# EAGLE design Turnout Decoder V1.1 (EAGLE 8.3.0)
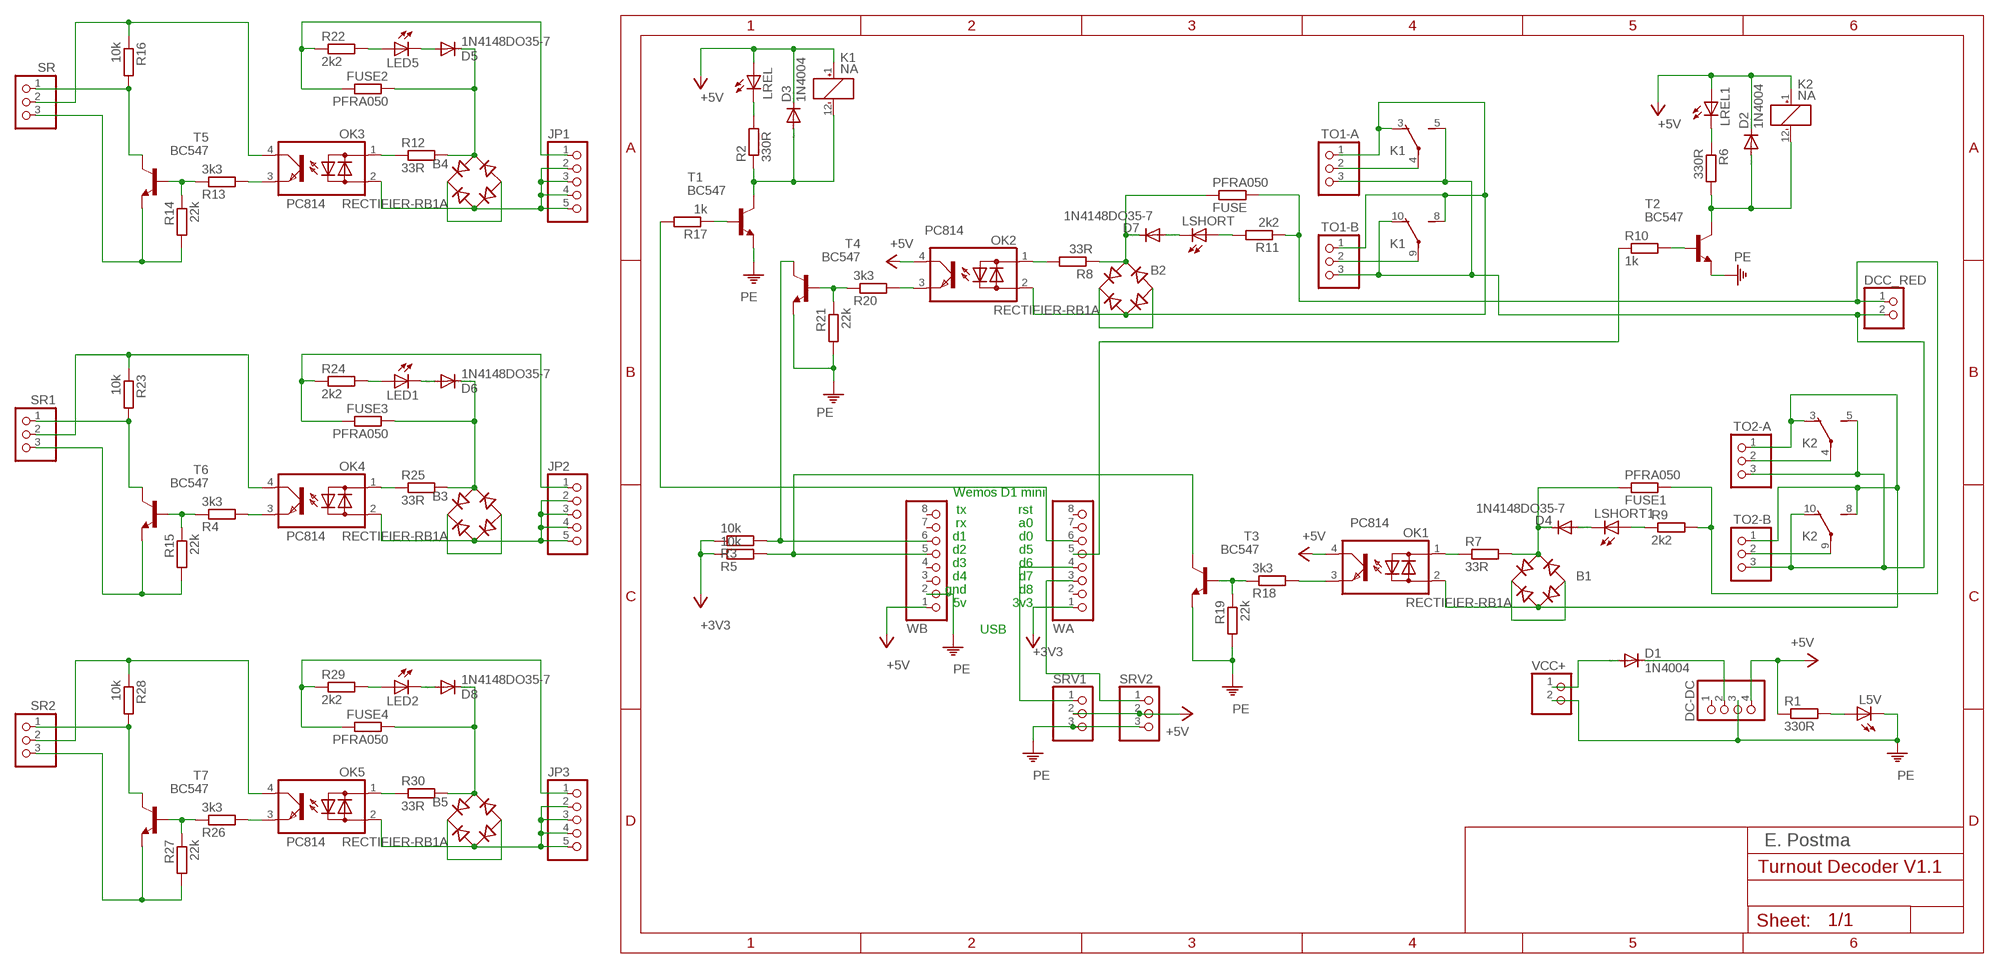
[diagram p0: schematic, sheet 1]

## Parts
B1  RECTIFIER-RB1A  [RB1A]
B2  RECTIFIER-RB1A  [RB1A]
B3  RECTIFIER-RB1A  [RB1A]
B4  RECTIFIER-RB1A  [RB1A]
B5  RECTIFIER-RB1A  [RB1A]
D1  1N4004  [DO41-10]
D2  1N4004  [DO41-10]
D3  1N4004  [DO41-10]
D4  1N4148DO35-7  [DO35-7]
D5  1N4148DO35-7  [DO35-7]
D6  1N4148DO35-7  [DO35-7]
D7  1N4148DO35-7  [DO35-7]
D8  1N4148DO35-7  [DO35-7]
DC-DC  PINHD-1X4  [1X04]
DCC_RED  PINHD-1X2  [1X02]
FUSE  PFRA050  R-EU_0414/5V  [0414V]
FUSE1  PFRA050  R-EU_0414/5V  [0414V]
FUSE2  PFRA050  R-EU_0414/5V  [0414V]
FUSE3  PFRA050  R-EU_0414/5V  [0414V]
FUSE4  PFRA050  R-EU_0414/5V  [0414V]
JP1  PINHD-1X5  [1X05]
JP2  PINHD-1X5  [1X05]
JP3  PINHD-1X5  [1X05]
K1  NA  [NA]
K2  NA  [NA]
L5V  LED3MM  [LED3MM]
LED1  LED3MM  [LED3MM]
LED2  LED3MM  [LED3MM]
LED5  LED3MM  [LED3MM]
LREL  LED3MM  [LED3MM]
LREL1  LED3MM  [LED3MM]
LSHORT  LED3MM  [LED3MM]
LSHORT1  LED3MM  [LED3MM]
OK1  PC814  [DIL04]
OK2  PC814  [DIL04]
OK3  PC814  [DIL04]
OK4  PC814  [DIL04]
OK5  PC814  [DIL04]
R1  330R  R-EU_0207/7  [0207/7]
R2  330R  R-EU_0207/7  [0207/7]
R3  10k  R-EU_0207/7  [0207/7]
R4  3k3  R-EU_0207/7  [0207/7]
R5  10k  R-EU_0207/7  [0207/7]
R6  330R  R-EU_0207/7  [0207/7]
R7  33R  R-EU_0207/7  [0207/7]
R8  33R  R-EU_0207/7  [0207/7]
R9  2k2  R-EU_0207/7  [0207/7]
R10  1k  R-EU_0207/7  [0207/7]
R11  2k2  R-EU_0207/7  [0207/7]
R12  33R  R-EU_0207/7  [0207/7]
R13  3k3  R-EU_0207/7  [0207/7]
R14  22k  R-EU_0207/7  [0207/7]
R15  22k  R-EU_0207/7  [0207/7]
R16  10k  R-EU_0207/7  [0207/7]
R17  1k  R-EU_0207/7  [0207/7]
R18  3k3  R-EU_0207/7  [0207/7]
R19  22k  R-EU_0207/7  [0207/7]
R20  3k3  R-EU_0207/7  [0207/7]
R21  22k  R-EU_0207/7  [0207/7]
R22  2k2  R-EU_0207/7  [0207/7]
R23  10k  R-EU_0207/7  [0207/7]
R24  2k2  R-EU_0207/7  [0207/7]
R25  33R  R-EU_0207/7  [0207/7]
R26  3k3  R-EU_0207/7  [0207/7]
R27  22k  R-EU_0207/7  [0207/7]
R28  10k  R-EU_0207/7  [0207/7]
R29  2k2  R-EU_0207/7  [0207/7]
R30  33R  R-EU_0207/7  [0207/7]
SR  PINHD-1X3  [1X03]
SR1  PINHD-1X3  [1X03]
SR2  PINHD-1X3  [1X03]
SRV1  PINHD-1X3  [1X03]
SRV2  PINHD-1X3  [1X03]
T1  BC547  [TO92]
T2  BC547  [TO92]
T3  BC547  [TO92]
T4  BC547  [TO92]
T5  BC547  [TO92]
T6  BC547  [TO92]
T7  BC547  [TO92]
TO1-A  PINHD-1X3  [1X03]
TO1-B  PINHD-1X3  [1X03]
TO2-A  PINHD-1X3  [1X03]
TO2-B  PINHD-1X3  [1X03]
VCC+  PINHD-1X2  [1X02]
WA  PINHD-1X8  [1X08]
WB  PINHD-1X8  [1X08]

## Nets
+3V3 [3.3V]: R3.1 R5.1 WA.1
+5V [5V]: D2.C D3.C DC-DC.4 K1.1(1:+) K2.1(1:+) LREL1.A LREL.A OK1.4(C) OK2.4(C) R1.1 SRV1.2 SRV2.2 WB.1
N$1: OK3.1(AC1) R12.1
N$2: LREL1.K(C) R6.1
N$3 [Rijstroom+]: DCC_RED.1 FUSE1.2 FUSE.2 R9.2 R11.1
N$4 [5V]: D1.A VCC+.1
N$5: OK1.1(AC1) R7.1
N$6: LSHORT1.A R9.1
N$7: D4.A LSHORT1.K(C)
N$8: D2.A K2.12(1:-) R6.2 T2.3(C)
N$9: R10.2 T2.2(B)
N$10 [Rijstroom+]: B1.+ B1.-
N$11: OK1.3(E) R18.2
N$12: LREL.K(C) R2.2
N$13 [Rijstroom+]: K2.4(2:P) TO2-A.2
N$14 [Rijstroom+]: B2.AC2 K1.3(2:O) K1.8(3:S) OK2.2(AC2) TO1-A.1 TO1-B.1
N$15 [Rijstroom-]: K2.9(3:P) TO2-B.2
N$16 [Rijstroom-]: DCC_RED.2 K1.5(2:S) K1.10(3:O) K2.5(2:S) K2.10(3:O) TO1-A.3 TO1-B.3 TO2-A.3 TO2-B.3
N$17: OK2.3(E) R20.2
N$18 [Rijstroom+]: B1.AC2 K2.3(2:O) K2.8(3:S) OK1.2(AC2) TO2-A.1 TO2-B.1
N$19: R3.2 T4.3(C) WB.6
N$20 [Rijstroom+]: B1.AC1 D4.C FUSE1.1 R7.2
N$21: OK2.1(AC1) R8.2
N$22: R5.2 T3.3(C) WB.5
N$23 [Rijstroom+]: B2.AC1 D7.C FUSE.1 R8.1
N$24: LED5.A R22.2
N$25: D5.A LED5.K(C)
N$26 [Rijstroom+]: K1.4(2:P) TO1-A.2
N$27: R18.1 R19.1 T3.2(B)
N$28: R20.1 R21.1 T4.2(B)
N$29: R17.2 WA.6
N$30 [Rijstroom+]: B4.AC1 D5.C FUSE2.1 R12.2
N$31: SRV1.1 WA.4
N$32 [Rijstroom-]: K1.9(3:P) TO1-B.2
N$33: SRV2.1 WA.3
N$34: R10.1 WA.5
N$35: LSHORT.A R11.2
N$36 [Rijstroom+]: B4.+ B4.-
N$37 [Rijstroom+]: FUSE2.2 JP1.1 R22.1
N$38: R13.1 R14.1 T5.2(B)
N$39: R16.2 SR.1 T5.3(C)
N$40 [Rijstroom+]: B4.AC2 JP1.2 JP1.3 JP1.4 JP1.5 OK3.2(AC2)
N$41: D7.A LSHORT.K(C)
N$42 [Rijstroom+]: B2.+ B2.-
N$43: OK3.3(E) R13.2
N$44: OK4.1(AC1) R25.1
N$45 [5V]: OK3.4(C) R16.1 SR.2
N$46: L5V.A R1.2
N$47: LED1.A R24.2
N$48: D6.A LED1.K(C)
N$49: R17.1 T1.2(B)
N$50: D3.A K1.12(1:-) R2.1 T1.3(C)
N$51 [Rijstroom+]: B3.AC1 D6.C FUSE3.1 R25.2
N$52 [Rijstroom+]: B3.+ B3.-
N$53 [Rijstroom+]: FUSE3.2 JP2.1 R24.1
N$54 [Rijstroom+]: B3.AC2 JP2.2 JP2.3 JP2.4 JP2.5 OK4.2(AC2)
N$55: R4.1 R15.1 T6.2(B)
N$56: R23.2 SR1.1 T6.3(C)
N$57: OK4.3(E) R4.2
N$58 [5V]: D1.C DC-DC.2
N$59 [5V]: OK4.4(C) R23.1 SR1.2
N$60 [Gnd]: R14.2 SR.3 T5.1(E)
N$61 [Gnd]: R15.2 SR1.3 T6.1(E)
N$62: OK5.1(AC1) R30.1
N$63: LED2.A R29.2
N$64: D8.A LED2.K(C)
N$65 [Rijstroom+]: B5.AC1 D8.C FUSE4.1 R30.2
N$66 [Rijstroom+]: B5.+ B5.-
N$67 [Rijstroom+]: FUSE4.2 JP3.1 R29.1
N$68 [Rijstroom+]: B5.AC2 JP3.2 JP3.3 JP3.4 JP3.5 OK5.2(AC2)
N$69: R26.1 R27.1 T7.2(B)
N$70: R28.2 SR2.1 T7.3(C)
N$71: OK5.3(E) R26.2
N$72 [5V]: OK5.4(C) R28.1 SR2.2
N$73 [Gnd]: R27.2 SR2.3 T7.1(E)
PE [Gnd]: DC-DC.3 L5V.K(C) R19.2 R21.2 SRV1.3 SRV2.3 T1.1(E) T2.1(E) T3.1(E) T4.1(E) VCC+.2 WB.2
Unconnected: DC-DC.1 WA.2 WA.7 WA.8 WB.3 WB.4 WB.7 WB.8

## Notes on the sheet
- Wemos D1 mini
- tx | rst
- rx | a0
- d1 | d0
- d2 | d5
- d3 | d6
- d4 | d7
- gnd | d8
- 5v | 3v3
- USB
- E. Postma

## Library data of the parts
B1-B5 = rectifier:RECTIFIER-: Rectifier
D1-D3 = diode:1N4004: DIODE general purpose rectifier, 1 A
D4-D8 = diode:1N4148: DIODE high speed (Philips)
DC-DC = pinhead:PINHD-1X4: PIN HEADER
DCC_RED VCC+ = pinhead:PINHD-1X2: PIN HEADER
FUSE FUSE1-FUSE4 R1-R30 = resistor:R-EU_: RESISTOR, European symbol
JP1-JP3 = pinhead:PINHD-1X5: PIN HEADER
K1 K2 = relay:NA: RELAY; OC_FARNELL: unknown; OC_NEWARK: unknown
L5V LED1 LED2 LED5 LREL LREL1 LSHORT LSHORT1 = led:LED: LED OSRAM: - CHIPLED LG R971, LG N971, LY N971, LG Q971, LY Q971, LO R971, LY R971 LH N974, LH R974 LS Q976, LO Q976, LY Q976 LO Q996 - Hyper CHIPLED LW Q18S LB Q993, LB Q99A, LB R99A - SideLED LS A670, LO A670, LY A670, LG A670, LP A670 LB A673, LV A673, LT A673, LW A673 LH A674 LY A675 LS A676, LA A676, LO A676, LY A676, LW A676 LS A679, LY A679, LG A679 - Hyper Micro SIDELED® LS Y876, LA Y876, LO Y876, LY Y876 LT Y87S - SmartLED LW L88C, LW L88S LB L89C, LB L89S, LG L890 LS L89K, LO L89K, LY L89K LS L896, LA L896, LO L896, LY L896 - TOPLED LS T670, LO T670, LY T670, LG T670, LP T670 LSG T670, LSP T670, LSY T670, LOP T670, LYG T670 LG T671, LOG T671, LSG T671 LB T673, LV T673, LT T673, LW T673 LH T674 LS T676, LA T676, LO T676, LY T676, LB T676, LH T676, LSB T676, LW T676 LB T67C, LV T67C, LT T67C, LS T67K, LO T67K, LY T67K, LW E67C LS E67B, LA E67B, LO E67B, LY E67B, LB E67C, LV E67C, LT E67C LW T67C LS T679, LY T679, LG T679 LS T770, LO T770, LY T770, LG T770, LP T770 LB T773, LV T773, LT T773, LW T773 LH T774 LS E675, LA E675, LY E675, LS T675 LS T776, LA T776, LO T776, LY T776, LB T776 LHGB T686 LT T68C, LB T68C - Hyper Mini TOPLED® LB M676 - Mini TOPLED Santana® LG M470 LS M47K, LO M47K, LY M47K Source: http://www.osram.convergy.de LUXEON: - LUMILED® LXK2-PW12-R00, LXK2-PW12-S00, LXK2-PW14-U00, LXK2-PW14-V00 LXK2-PM12-R00, LXK2-PM12-S00, LXK2-PM14-U00 LXK2-PE12-Q00, LXK2-PE12-R00, LXK2-PE12-S00, LXK2-PE14-T00, LXK2-PE14-U00 LXK2-PB12-K00, LXK2-PB12-L00, LXK2-PB12-M00, LXK2-PB14-N00, LXK2-PB14-P00, LXK2-PB14-Q00 LXK2-PR12-L00, LXK2-PR12-M00, LXK2-PR14-Q00, LXK2-PR14-R00 LXK2-PD12-Q00, LXK2-PD12-R00, LXK2-PD12-S00 LXK2-PH12-R00, LXK2-PH12-S00 LXK2-PL12-P00, LXK2-PL12-Q00, LXK2-PL12-R00 Source: www.luxeon.com KINGBRIGHT: KA-3528ASYC Source: www.kingbright.com
OK1-OK5 = optocoupler:PC814: SHARP OPTO COUPLER; OC_FARNELL: 9707662; OC_NEWARK: unknown
SR SR1 SR2 SRV1 SRV2 TO1-A TO1-B TO2-A TO2-B = pinhead:PINHD-1X3: PIN HEADER
T1-T7 = transistor:BC547: NPN TRANSISTOR
WA WB = pinhead:PINHD-1X8: PIN HEADER

## Net classes
0 default: width 0.508 mm, clearance 0.254 mm
1 5V: width 0.762 mm, clearance 0.254 mm
2 Gnd: width 0.762 mm, clearance 0.254 mm
3 Extra: width 1.016 mm, clearance 0.254 mm
4 Rijstroom+: width 1.016 mm, clearance 0.254 mm
5 3.3V: width 0.508 mm, clearance 0.254 mm
6 Rijstroom-: width 1.016 mm, clearance 0.254 mm

## Board
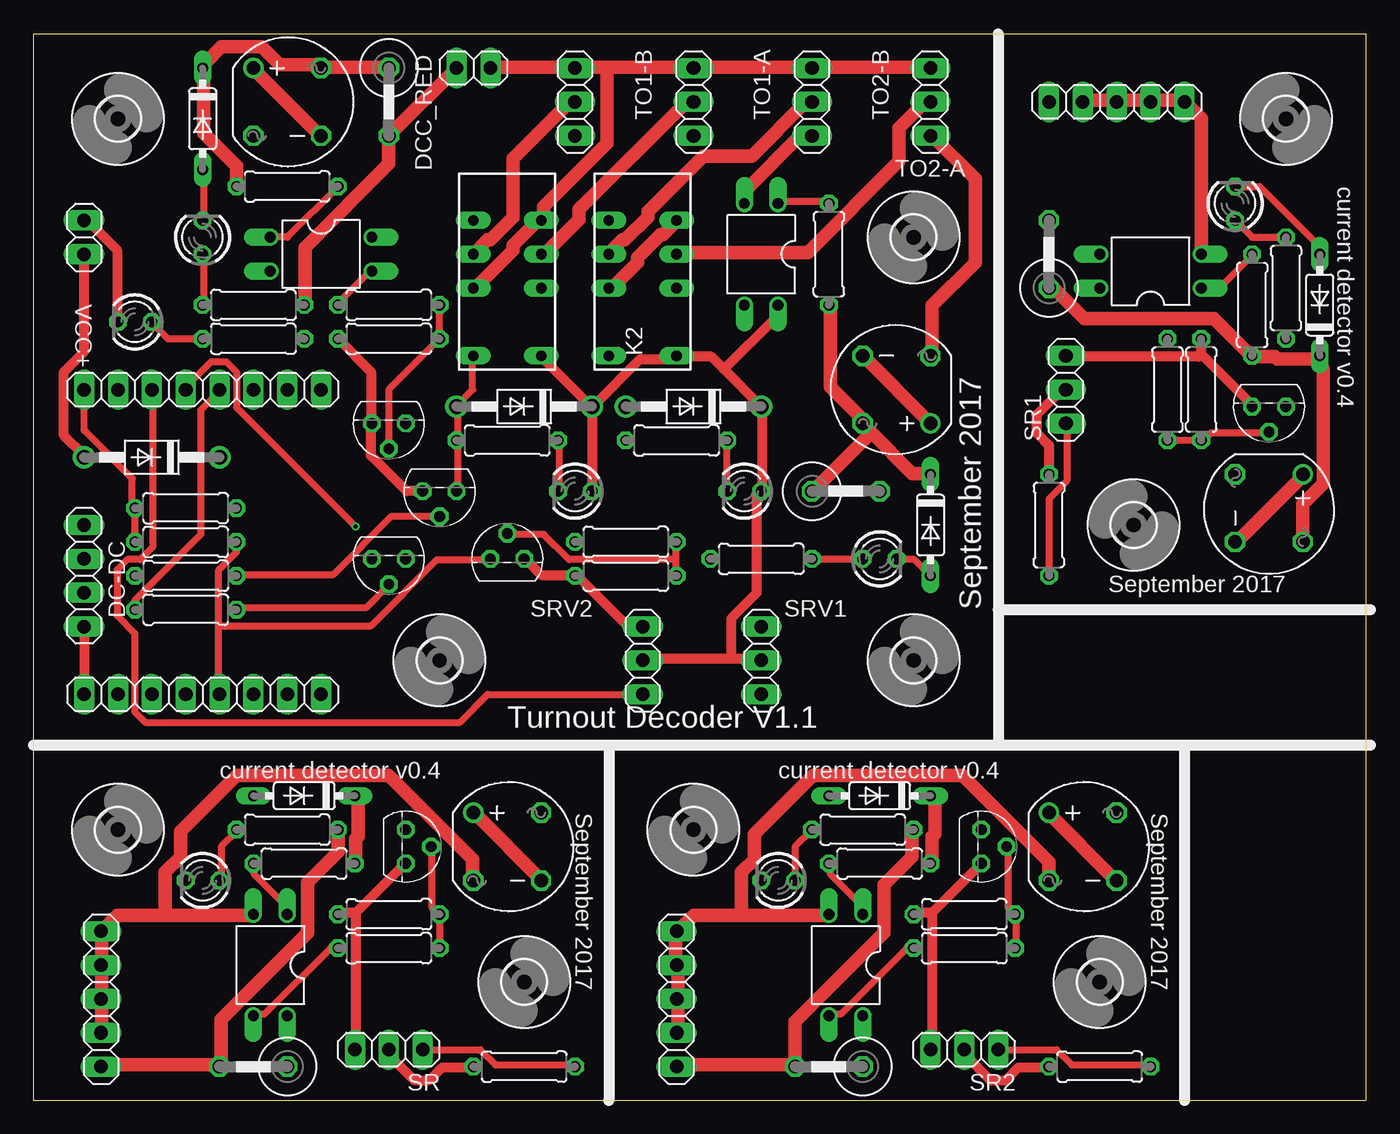
[diagram p1: board, top side]
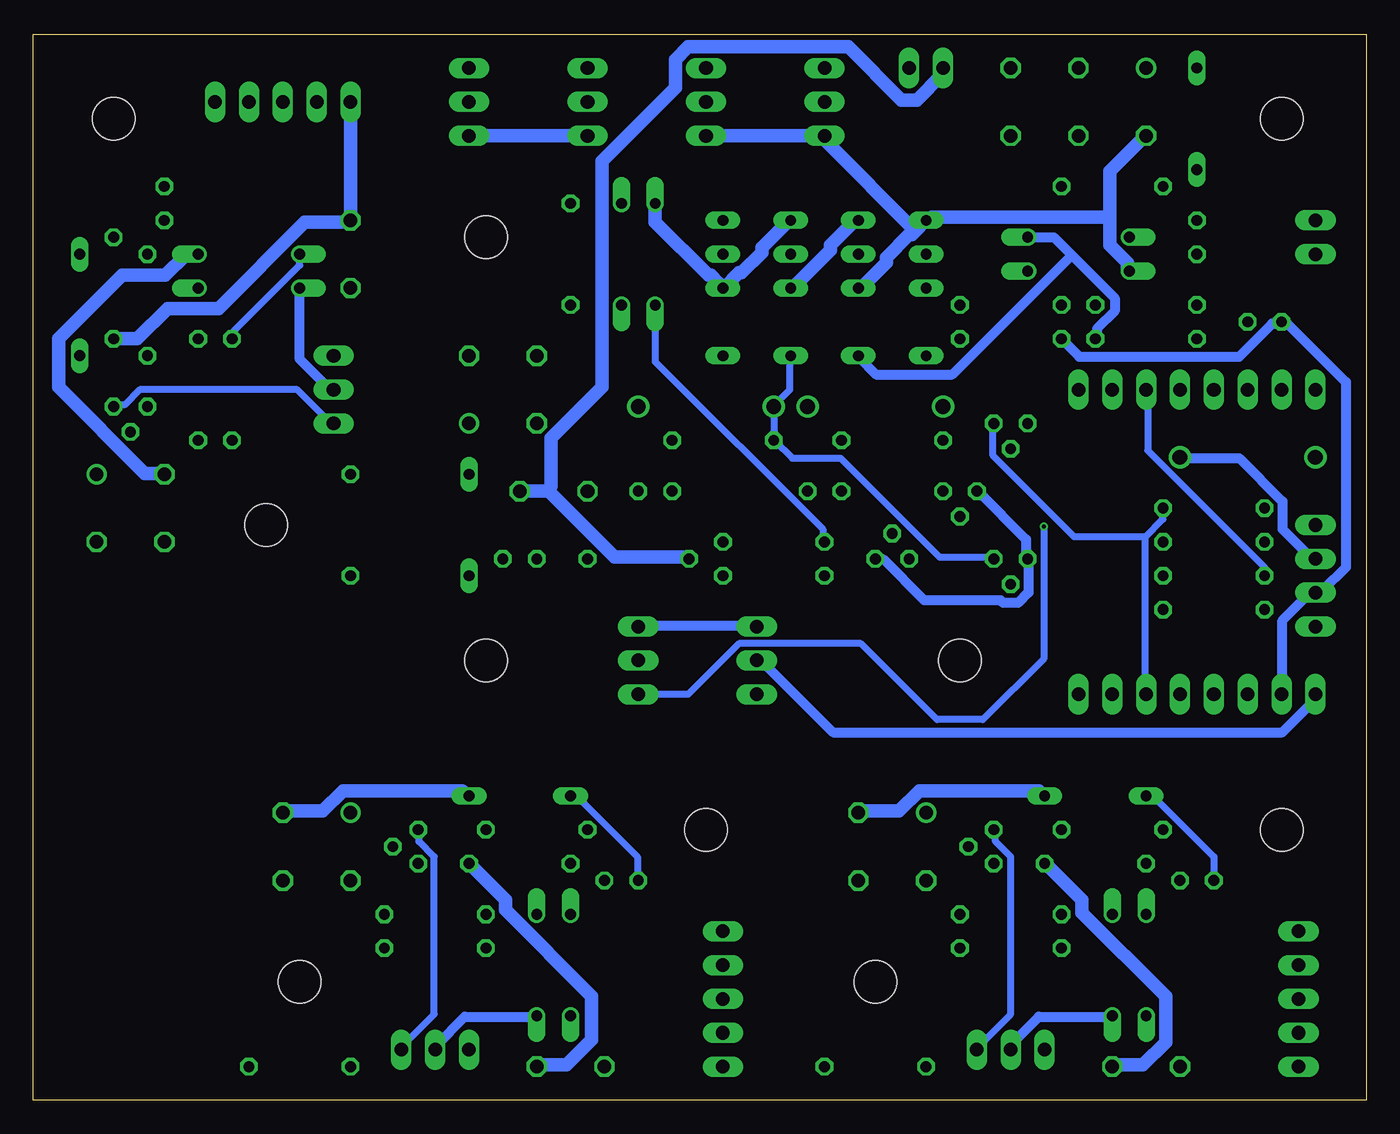
[diagram p2: board, bottom side, seen from below]

Size 100 x 80 mm. Coordinates in mm from the lower left corner, seen from the top.
Outline: 0,0 100,0 100,80 0,80 0,0
Copper layers (1*16): Top 0.035mm / dielectric 1.5mm / Bottom 0.035mm
Design rules "NOA Eagle Rule 2016-06-12": minimum track width 6mil, minimum drill 0.3mm, track to track 6mil, track to pad 6mil, pad to pad 6mil, via to via 6mil, smd to smd 0mil, copper to edge 0.4mm, drill to drill 10mil, minimum pad ring 10mil, minimum via ring 6mil, stop-mask expansion 2mil, vias tented up to drill 25mil, thermal gap 10mil
tRestrict: 3 lines
bRestrict: 3 lines

### Footprints (pad centres in the part's own frame; a part is rotated, then mirrored left to right if it is on the bottom)
RB1A = drill 1.016: + -2.54,2.54 | drill 1.016 octagon: - 2.54,-2.54; AC1 2.54,2.54; AC2 -2.54,-2.54
DO41-10 = drill 1.118: A 5.08,0; C -5.08,0
DO35-7 = drill 0.813 long: A 3.81,0; C -3.81,0
1X04 = drill 1.016 long: 1 -3.81,0; 2 -1.27,0; 3 1.27,0; 4 3.81,0
1X02 = drill 1.016 long: 1 -1.27,0; 2 1.27,0
0414V = drill 1.016 octagon: 1 -2.54,0; 2 2.54,0
1X05 = drill 1.016 long: 1 -5.08,0; 2 -2.54,0; 3 0,0; 4 2.54,0; 5 5.08,0
NA = drill 0.8 long: 1 -6.35,-2.54; 3 -1.27,-2.54; 4 1.27,-2.54; 5 3.81,-2.54; 8 3.81,2.54; 9 1.27,2.54; 10 -1.27,2.54; 12 -6.35,2.54
LED3MM = drill 0.813 octagon: A -1.27,0; K 1.27,0
DIL04 = drill 0.813 offset: 1 -1.27,-3.81; 2 1.27,-3.81; 3 1.27,3.81; 4 -1.27,3.81
0207/7 = drill 0.813 octagon: 1 -3.81,0; 2 3.81,0
1X03 = drill 1.016 long: 1 -2.54,0; 2 0,0; 3 2.54,0
TO92 = drill 0.813 octagon: 1 1.27,0; 2 0,1.905; 3 -1.27,0
3,2 = hole 3.2: 0,0
1X08 = drill 1.016 long: 1 -8.89,0; 2 -6.35,0; 3 -3.81,0; 4 -1.27,0; 5 1.27,0; 6 3.81,0; 7 6.35,0; 8 8.89,0

### Placement (x,y rotation side)
B1  64.77,53.34 180 top
B2  19.05,74.93 0 top
B3  92.71,44.45 270 top
B4  35.56,19.05 0 top
B5  78.74,19.05 0 top
D1  8.89,48.26 180 top
D2  49.53,52.07 180 top
D3  36.83,52.07 180 top
D4  67.31,43.18 270 top
D5  20.32,22.86 180 top
D6  96.52,59.69 90 top
D7  12.7,73.66 270 top
D8  63.5,22.86 180 top
DC-DC  3.81,39.37 270 top
DCC_RED  33.02,77.47 0 top
FUSE  26.67,74.93 270 top
FUSE1  60.96,45.72 0 top
FUSE2  16.51,2.54 180 top
FUSE3  76.2,63.5 90 top
FUSE4  59.69,2.54 180 top
JP1  5.08,7.62 90 top
JP2  81.28,74.93 0 top
JP3  48.26,7.62 90 top
K1  35.56,62.23 90 top
K2  45.72,62.23 90 top
L5V  7.62,58.42 180 top
LED1  90.17,67.31 90 top
LED2  55.88,16.51 180 top
LED5  12.7,16.51 180 top
LREL  40.64,45.72 180 top
LREL1  53.34,45.72 180 top
LSHORT  12.7,64.77 90 top
LSHORT1  63.5,40.64 0 top
OK1  54.61,63.5 180 top
OK2  21.59,63.5 270 top
OK3  17.78,10.16 180 top
OK4  83.82,62.23 90 top
OK5  60.96,10.16 180 top
R1  16.51,57.15 180 top
R2  35.56,49.53 0 top
R3  11.43,44.45 0 top
R4  85.09,53.34 90 top
R5  11.43,41.91 0 top
R6  48.26,49.53 180 top
R7  59.69,63.5 270 top
R8  19.05,68.58 0 top
R9  54.61,40.64 180 top
R10  11.43,36.83 0 top
R11  16.51,59.69 180 top
R12  20.32,17.78 0 top
R13  26.67,11.43 180 top
R14  26.67,13.97 180 top
R15  87.63,53.34 90 top
R16  36.83,2.54 0 top
R17  11.43,39.37 180 top
R18  44.45,41.91 180 top
R19  44.45,39.37 180 top
R20  26.67,59.69 180 top
R21  26.67,57.15 180 top
R22  19.05,20.32 180 top
R23  76.2,43.18 270 top
R24  93.98,60.96 90 top
R25  91.44,59.69 270 top
R26  69.85,11.43 180 top
R27  69.85,13.97 180 top
R28  80.01,2.54 0 top
R29  62.23,20.32 180 top
R30  63.5,17.78 0 top
SR  26.67,3.81 180 top
SR1  77.47,53.34 90 top
SR2  69.85,3.81 180 top
SRV1  54.61,33.02 90 top
SRV2  45.72,33.02 90 top
T1  30.48,45.72 180 top
T2  26.67,40.64 180 top
T3  35.56,40.64 0 top
T4  26.67,50.8 180 top
T5  27.94,19.05 270 top
T6  92.71,52.07 180 top
T7  71.12,19.05 270 top
TO1-A  49.53,74.93 90 top
TO1-B  40.64,74.93 90 top
TO2-A  67.31,74.93 90 top
TO2-B  58.42,74.93 90 top
U$1  [3,2]  6.35,73.66 0 top
U$2  [3,2]  66.04,64.77 0 top
U$3  [3,2]  30.48,33.02 0 top
U$4  [3,2]  66.04,33.02 0 top
U$5  [3,2]  6.35,20.32 0 top
U$6  [3,2]  36.83,8.89 0 top
U$7  [3,2]  93.98,73.66 270 top
U$8  [3,2]  82.55,43.18 270 top
U$9  [3,2]  49.53,20.32 0 top
U$10  [3,2]  80.01,8.89 0 top
VCC+  3.81,64.77 90 top
WA  12.7,53.34 0 top
WB  12.7,30.48 0 top

### Tracks (layer width: path | path; a pad name or v marks a point on that pad's centre or on a via)
+3V3
  Top 0.508: R5.1 R3.1 7.43,44.58 7.43,46.67 3.81,50.29 WA.1
+5V
  Top 0.762: 51.82,54.86 D2.C 54.67,51.82 54.67,45.72 LREL1.A 54.29,45.53 54.29,38.1 52.39,36.2 52.39,33.15 | 51.82,54.86 50.86,55.82 48.39,55.82 K2.1 48.01,55.63 45.53,55.63 42.1,52.2 D3.C | 51.82,54.86 55.82,58.86 55.82,59.63 OK1.4 | K1.1 38.1,55.82 41.91,52.01 D3.C | D3.C LREL.A | DC-DC.4 WB.1 | 52.39,33.15 54.48,33.15 SRV1.2 | 52.39,33.15 45.72,33.15 SRV2.2
  Bottom 0.762: 22.1,63.44 23.43,64.77 OK2.4 | 22.1,63.44 18.86,60.2 18.86,59.24 20.19,57.91 20.19,57.15 R1.1 | 22.1,63.44 31.05,54.48 36.77,54.48 38.1,55.82 K1.1 | WB.1 3.81,30.1 6.29,27.62 40.01,27.62 45.34,32.96 45.72,32.96 SRV2.2
N$1
  Top 0.508: OK3.1 19.05,14.48 16.57,16.95 16.57,17.72 R12.1
N$2
  Top 0.508: LREL1.K 52.01,45.72 52.01,49.53 R6.1
N$3
  Top 1.016: R11.1 20.38,59.82 20.38,64.01 26.67,70.29 FUSE.2 DCC_RED.1
  Bottom 1.016: 61.34,45.72 56.39,40.77 50.86,40.77 R9.2 | FUSE1.2 61.34,45.72 | 61.34,45.72 61.15,46.1 61.15,49.72 57.34,53.53 57.34,70.48 51.82,76.01 51.82,78.11 50.86,79.06 38.86,79.06 34.86,75.06 33.72,75.06 31.81,76.96 31.81,77.34 DCC_RED.1
N$4
  Top 0.762: VCC+.1 3.81,56.2 2.29,54.67 2.29,49.91 3.81,48.39 D1.A
N$5
  Top 0.508: OK1.1 56.01,67.44 59.63,67.44 R7.1
N$6
  Top 0.508: R9.1 58.48,40.58 62.1,40.58 LSHORT1.A
N$7
  Top 0.508: D4.A 66.1,40.58 64.77,40.58 LSHORT1.K
N$8
  Bottom 0.508: K2.12 43.24,55.82 43.24,53.34 44.39,52.2 D2.A 44.39,52.01 44.39,49.72 R6.2 44.39,49.53 43.05,48.2 39.43,48.2 32,40.77 28,40.77 T2.3
N$9
  Top 0.508: R10.2 15.24,36.96 24.96,36.96 26.67,38.67 T2.2
N$10
  Top 1.016: B1.+ B1.-
N$11
  Bottom 0.508: OK1.3 53.34,55.44 40.77,42.86 40.77,41.91 R18.2
N$12
  Top 0.508: LREL.K 39.43,45.72 39.43,49.53 R2.2
N$13
  Top 1.016: K2.4 48.39,63.63 58.1,63.63 64.96,70.48 64.96,72.96 66.86,74.87 67.25,74.87 TO2-A.2
N$14
  Bottom 1.016: 19.24,66.29 19.24,69.72 16.57,72.39 B2.AC2 | 19.24,66.29 19.24,64.2 17.91,62.87 17.91,62.29 OK2.2 | 33.81,65.25 34.1,64.96 34.29,64.96 36.01,63.25 36.01,62.87 37.91,60.96 K1.3 | 33.81,65.25 K1.8 32.58,66.29 19.24,66.29 | TO1-A.1 TO1-B.1 40.58,72.01 33.81,65.25
N$15
  Top 1.016: K2.9 43.24,63.63 44.2,64.58 44.39,64.58 46.1,66.29 46.1,66.67 50.29,70.87 53.91,70.87 57.91,74.87 58.29,74.87 TO2-B.2
N$16
  Top 1.016: K1.10 33.15,60.96 36.01,63.82 36.01,64.2 37.72,65.91 38.1,65.91 K1.5 38.29,66.48 38.29,67.06 43.05,71.82 43.05,77.53 | K2.10 43.43,60.96 45.34,62.87 45.34,63.25 47.05,64.96 47.24,64.96 48.2,65.91 K2.5 | DCC_RED.2 34.29,77.53 40.58,77.53 TO1-B.3 40.96,77.53 43.05,77.53 | 43.05,77.53 49.53,77.53 TO1-A.3 49.91,77.53 58.29,77.53 TO2-B.3 58.86,77.53 67.25,77.53 TO2-A.3
  Bottom 1.016: K2.10 43.05,60.96 40.2,63.82 40.2,64.2 38.48,65.91 38.1,65.91 K1.5
N$17
  Top 0.508: R20.2 22.86,59.82 25.34,62.29 OK2.3
N$18
  Top 1.016: B1.AC2 67.44,56.01 67.44,59.63 70.67,62.87 70.67,69.15 67.44,72.39 TO2-A.1 | OK1.2 53.34,68.2 57.53,72.39 TO2-B.1
  Bottom 1.016: K2.8 43.24,66.1 45.34,64.01 45.34,63.63 46.86,62.1 47.05,62.1 48.2,60.96 K2.3 48.58,61.34 49.15,61.91 49.34,61.91 53.34,65.91 OK1.2 | TO2-B.1 TO2-A.1
N$19
  Bottom 0.508: R3.2 15.24,43.62 16.57,42.29 | 16.57,42.29 16.57,30.48 WB.6 | 16.57,42.29 21.91,42.29 28,48.39 28,50.67 T4.3
N$20
  Top 1.016: 62.87,50.1 62.29,50.67 B1.AC1 62.1,51.24 59.82,53.53 59.82,59.63 R7.2 | 62.87,50.1 65.91,47.05 67.25,47.05 D4.C | 62.87,50.1 58.48,45.72 FUSE1.1
N$21
  Top 0.508: OK2.1 19.05,64.77 R8.2
N$22
  Top 0.508: R5.2 15.24,41.15 13.91,39.81 13.91,35.62 | 13.91,35.62 13.91,30.48 WB.5 | 13.91,35.62 25.34,35.62 30.29,40.58 34.29,40.58 T3.3
N$23
  Top 1.016: FUSE.1 26.67,77.53 21.72,77.53 B2.AC1 21.14,77.72 18.48,77.72 17.14,79.06 14.1,79.06 12.95,77.92 D7.C 12.76,77.34 12.76,72.58 15.24,70.1 R8.1
N$24
  Top 0.508: LED5.A 14.1,16.57 14.1,19.05 15.24,20.19 R22.2
N$25
  Bottom 0.508: LED5.K 11.43,18.29 16,22.86 D5.A
N$26
  Top 1.016: K1.4 38.1,63.63 38.48,63.63 40.96,66.1 40.96,66.86 48.96,74.87 49.53,74.87 TO1-A.2
N$27
  Top 0.508: 48.2,40.58 48.2,41.91 R18.1 | 48.2,40.58 48.2,39.43 R19.1 | 48.2,40.58 40.2,40.58 38.29,42.48 35.62,42.48 T3.2
N$28
  Top 0.508: T4.2 26.67,53.34 R21.1 R20.1
N$29
  Bottom 0.508: R17.2 7.62,40.01 16.38,48.77 16.38,53.34 WA.6
N$30
  Top 1.016: R12.2 24.19,17.91 24.19,19.62 24.38,19.81 24.38,22.67 24.19,22.86 D5.C
  Bottom 1.016: FUSE2.1 19.05,2.67 16.76,2.67 15.05,4.38 15.05,7.81 21.34,14.1 21.34,15.05 24,17.72 R12.2 | B4.AC1 38.1,21.72 35.05,21.72 33.53,23.24 24.57,23.24 24.19,22.86 D5.C
N$31  (via drill 0.3)
  Top 0.508: v24.19,43.05 15.24,52.01 15.24,54.67 14.48,55.44 13.34,55.44 11.43,53.53 WA.4
  Bottom 0.508: SRV1.1 50.86,30.48 47.05,34.29 37.91,34.29 32.19,28.57 28.77,28.57 24.19,33.15 v24.19,43.05
N$32
  Top 1.016: K1.9 34.1,64.58 34.29,64.58 36.01,66.29 36.01,70.67 40.2,74.87 40.58,74.87 TO1-B.2
N$33
  Top 0.508: SRV2.1 34.1,30.48 32,28.38 8.38,28.38 7.62,29.15 7.62,35.05 6.29,36.39 6.29,39.81 7.05,40.58 8,40.58 8.95,41.53 8.95,53.34 WA.3
N$34
  Top 0.508: R10.1 7.62,37.53 12.57,42.48 12.57,51.82 14.1,53.34 WA.5
N$35
  Top 0.508: R11.2 12.76,59.82 12.76,63.44 LSHORT.A
N$36
  Top 1.016: B4.- 38.1,16.57 33.15,21.53 B4.+
N$37
  Top 1.016: R22.1 22.86,18.67 20.57,16.38 20.57,12.57 14.1,6.1 14.1,2.67 FUSE2.2 13.53,2.67 5.14,2.67 JP1.1
N$38
  Top 0.508: R13.1 R14.1 30.29,14.1 29.91,14.48 29.91,19.05 T5.2
N$39
  Top 0.508: SR.1 33.53,3.81 34.67,2.67 40.58,2.67 R16.2
  Bottom 0.508: T5.3 27.81,20.19 27.81,19.43 26.67,18.29 26.67,6.48 29.34,3.81 SR.1
N$40
  Top 1.016: JP1.2 5.14,5.14 5.14,7.62 JP1.3 5.14,8 5.14,9.72 JP1.4 5.14,10.29 5.14,12.38 JP1.5 6.29,13.91 9.91,13.91 | 9.91,13.91 16.38,13.91 OK3.2 | 9.91,13.91 9.91,17.14 11.05,18.29 11.05,20.19 15.24,24.38 26.67,24.38 32.96,18.1 32.96,16.57 B4.AC2
N$41
  Top 0.508: LSHORT.K 12.76,66.1 12.76,69.72 D7.A
N$42
  Top 1.016: B2.- 21.53,72.39 16.57,77.34 B2.+
N$43
  Top 0.508: R13.2 22.29,11.43 17.34,6.48 16.57,6.48 OK3.3
N$44
  Top 0.508: OK4.1 88.96,60.96 91.44,63.44 R25.1
N$45
  Top 0.762: SR.2 26.67,3.43 28.57,1.52 29.72,1.52 30.67,2.48 32.96,2.48 R16.1
  Bottom 0.762: SR.2 26.67,4.19 24.57,6.29 19.05,6.29 OK3.4
N$46
  Top 0.508: R1.2 10.1,57.15 8.95,58.29 L5V.A
N$47
  Top 0.508: R24.2 91.44,64.77 LED1.A
N$48
  Top 0.508: LED1.K 92.01,68.58 96.39,64.2 96.39,63.63 D6.A
N$49
  Top 0.508: T1.2 26.86,43.81 22.48,39.43 15.24,39.43 R17.1
N$50
  Top 0.508: T1.3 31.81,45.72 31.81,49.53 R2.1 31.81,49.72 31.81,52.01 D3.A 31.81,52.2 32.96,53.34 32.96,55.82 K1.12
N$51
  Top 1.016: FUSE3.1 76.58,60.96 78.87,58.67 88.58,58.67 91.06,56.2 R25.2 91.44,55.82 93.15,55.82 93.34,55.63 96.2,55.63 96.39,55.82 D6.C 96.39,55.24 96.77,54.86 96.77,46.29 95.25,44.77 B3.AC1
N$52
  Top 1.016: B3.- 90.3,41.91 95.25,46.86 B3.+
N$53
  Bottom 1.016: R24.1 92.2,57.15 89.92,59.44 86.11,59.44 79.63,65.91 76.2,65.91 FUSE3.2 JP2.1
N$54
  Top 1.016: JP2.2 78.87,75.06 81.15,75.06 JP2.3 81.72,75.06 83.82,75.06 JP2.4 84.2,75.06 85.92,75.06 JP2.5 86.49,74.87 87.63,73.72 OK4.2
  Bottom 1.016: B3.AC2 90.3,47.05 91.63,47.05 98.11,53.53 98.11,57.15 93.34,61.91 90.11,61.91 88.58,63.44 87.63,63.44 OK4.2
N$55
  Top 0.508: R4.1 R15.1 87.82,49.53 88.39,50.1 92.58,50.1 T6.2
N$56
  Top 0.508: R23.2 76.2,45.15 77.53,46.48 77.53,50.67 SR1.1
  Bottom 0.508: T6.3 93.92,52.2 93.15,52.2 92.01,53.34 80.2,53.34 77.53,50.67 SR1.1
N$57
  Bottom 0.508: OK4.3 80.01,62.67 84.96,57.72 84.96,57.15 R4.2
N$58
  Bottom 0.762: DC-DC.2 3.81,40.77 4.19,40.77 6.29,42.86 6.29,44.96 9.53,48.2 13.91,48.2 D1.C
N$59
  Top 0.762: R23.1 76.2,49.15 75.25,50.1 75.25,51.44 77.15,53.34 SR1.2
  Bottom 0.762: OK4.4 80.01,55.63 77.72,53.34 SR1.2
N$60
  Top 0.762: 24.19,14.1 22.86,14.1 R14.2 | 24.19,14.1 27.81,17.72 T5.1 | 24.19,14.1 24.19,3.81 SR.3
N$61
  Top 0.762: 87.63,56.01 R15.2 | 87.63,56.01 91.44,52.2 T6.1 | SR1.3 77.53,55.82 87.44,55.82 87.63,56.01
N$62
  Top 0.508: R30.1 59.82,17.72 59.82,16.95 62.1,14.67 62.1,14.1 OK5.1
N$63
  Top 0.508: LED2.A 57.15,19.05 R29.2
N$64
  Bottom 0.508: D8.A 59.24,22.86 54.67,18.29 54.67,16.57 LED2.K
N$65
  Top 1.016: R30.2 67.44,17.91 67.44,19.81 67.63,20 67.63,22.67 67.44,22.86 D8.C
  Bottom 1.016: R30.2 64.58,15.05 64.58,14.29 58.1,7.81 58.1,4.57 60.01,2.67 62.1,2.67 FUSE4.1 | B5.AC1 81.15,21.72 78.3,21.72 76.77,23.24 67.82,23.24 67.44,22.86 D8.C
N$66
  Top 1.016: B5.- 81.15,16.57 76.2,21.53 B5.+
N$67
  Top 1.016: R29.1 65.91,20.19 65.91,18.29 63.82,16.19 63.82,12.57 57.15,5.91 FUSE4.2 56.77,2.67 48.39,2.67 JP3.1
N$68
  Top 1.016: JP3.2 48.39,5.14 48.39,7.62 JP3.3 48.39,8 48.39,9.72 JP3.4 48.2,10.29 48.2,12.19 JP3.5 48.39,12.76 49.53,13.91 53.15,13.91 | 53.15,13.91 59.63,13.91 OK5.2 | B5.AC2 76.2,17.91 69.72,24.38 58.48,24.38 54.1,20 54.1,18.1 53.15,17.14 53.15,13.91
N$69
  Top 0.508: R26.1 73.72,11.43 73.72,13.91 R27.1 73.15,14.48 73.15,19.05 T7.2
N$70
  Top 0.508: SR2.1 76.77,3.81 77.92,2.67 83.82,2.67 R28.2
  Bottom 0.508: SR2.1 72.39,4 69.91,6.48 69.91,18.29 71.06,19.43 71.06,20.19 T7.3
N$71
  Top 0.508: R26.2 65.53,11.43 60.58,6.48 59.82,6.48 OK5.3
N$72
  Top 0.762: R28.1 76.2,2.48 73.91,2.48 72.96,1.52 71.82,1.52 69.91,3.43 69.91,3.81 SR2.2
  Bottom 0.762: OK5.4 62.29,6.29 67.63,6.29 69.72,4.19 69.72,3.81 SR2.2
N$73
  Top 0.762: 67.44,14.1 66.1,14.1 R27.2 | T7.1 67.44,14.1 | 67.44,14.1 67.44,3.81 SR2.3
PE
  Top 0.762: T3.1 36.96,40.58 38.1,39.43 40.58,39.43 R19.2 40.96,39.24 44.58,35.62 45.72,35.62 SRV2.3 | L5V.K 6.29,58.48 6.29,63.82 4.19,65.91 3.81,65.91 VCC+.2 | R21.2 25.34,54.67 25.34,50.86 T4.1 25.34,50.48 25.34,48.39 28,45.72 T1.1
  Bottom 0.762: SRV1.3 54.48,35.62 45.72,35.62 SRV2.3 | WB.2 6.29,30.48 6.29,36.01 4.19,38.1 DC-DC.3 3.62,38.29 3.24,38.29 1.52,40.01 1.52,53.91 6.1,58.48 L5V.K 6.48,58.29 7.05,58.29 9.53,55.82 21.53,55.82 R21.2 | T1.1 29.15,45.72 25.53,42.1 25.53,40.77 T2.1 25.34,40.39 25.34,38.1 26.1,37.34 27.24,37.34 27.43,37.53 33.15,37.53 36.2,40.58 36.77,40.58 T3.1

### Text on the board
tNames: current detector v0.4 | September 2017 | September 2017 | Turnout Decoder V1.1 | current detector v0.4 | current detector v0.4 | September 2017 | September 2017